# Altium schematic sheet Sheet3.SchDoc
size A3
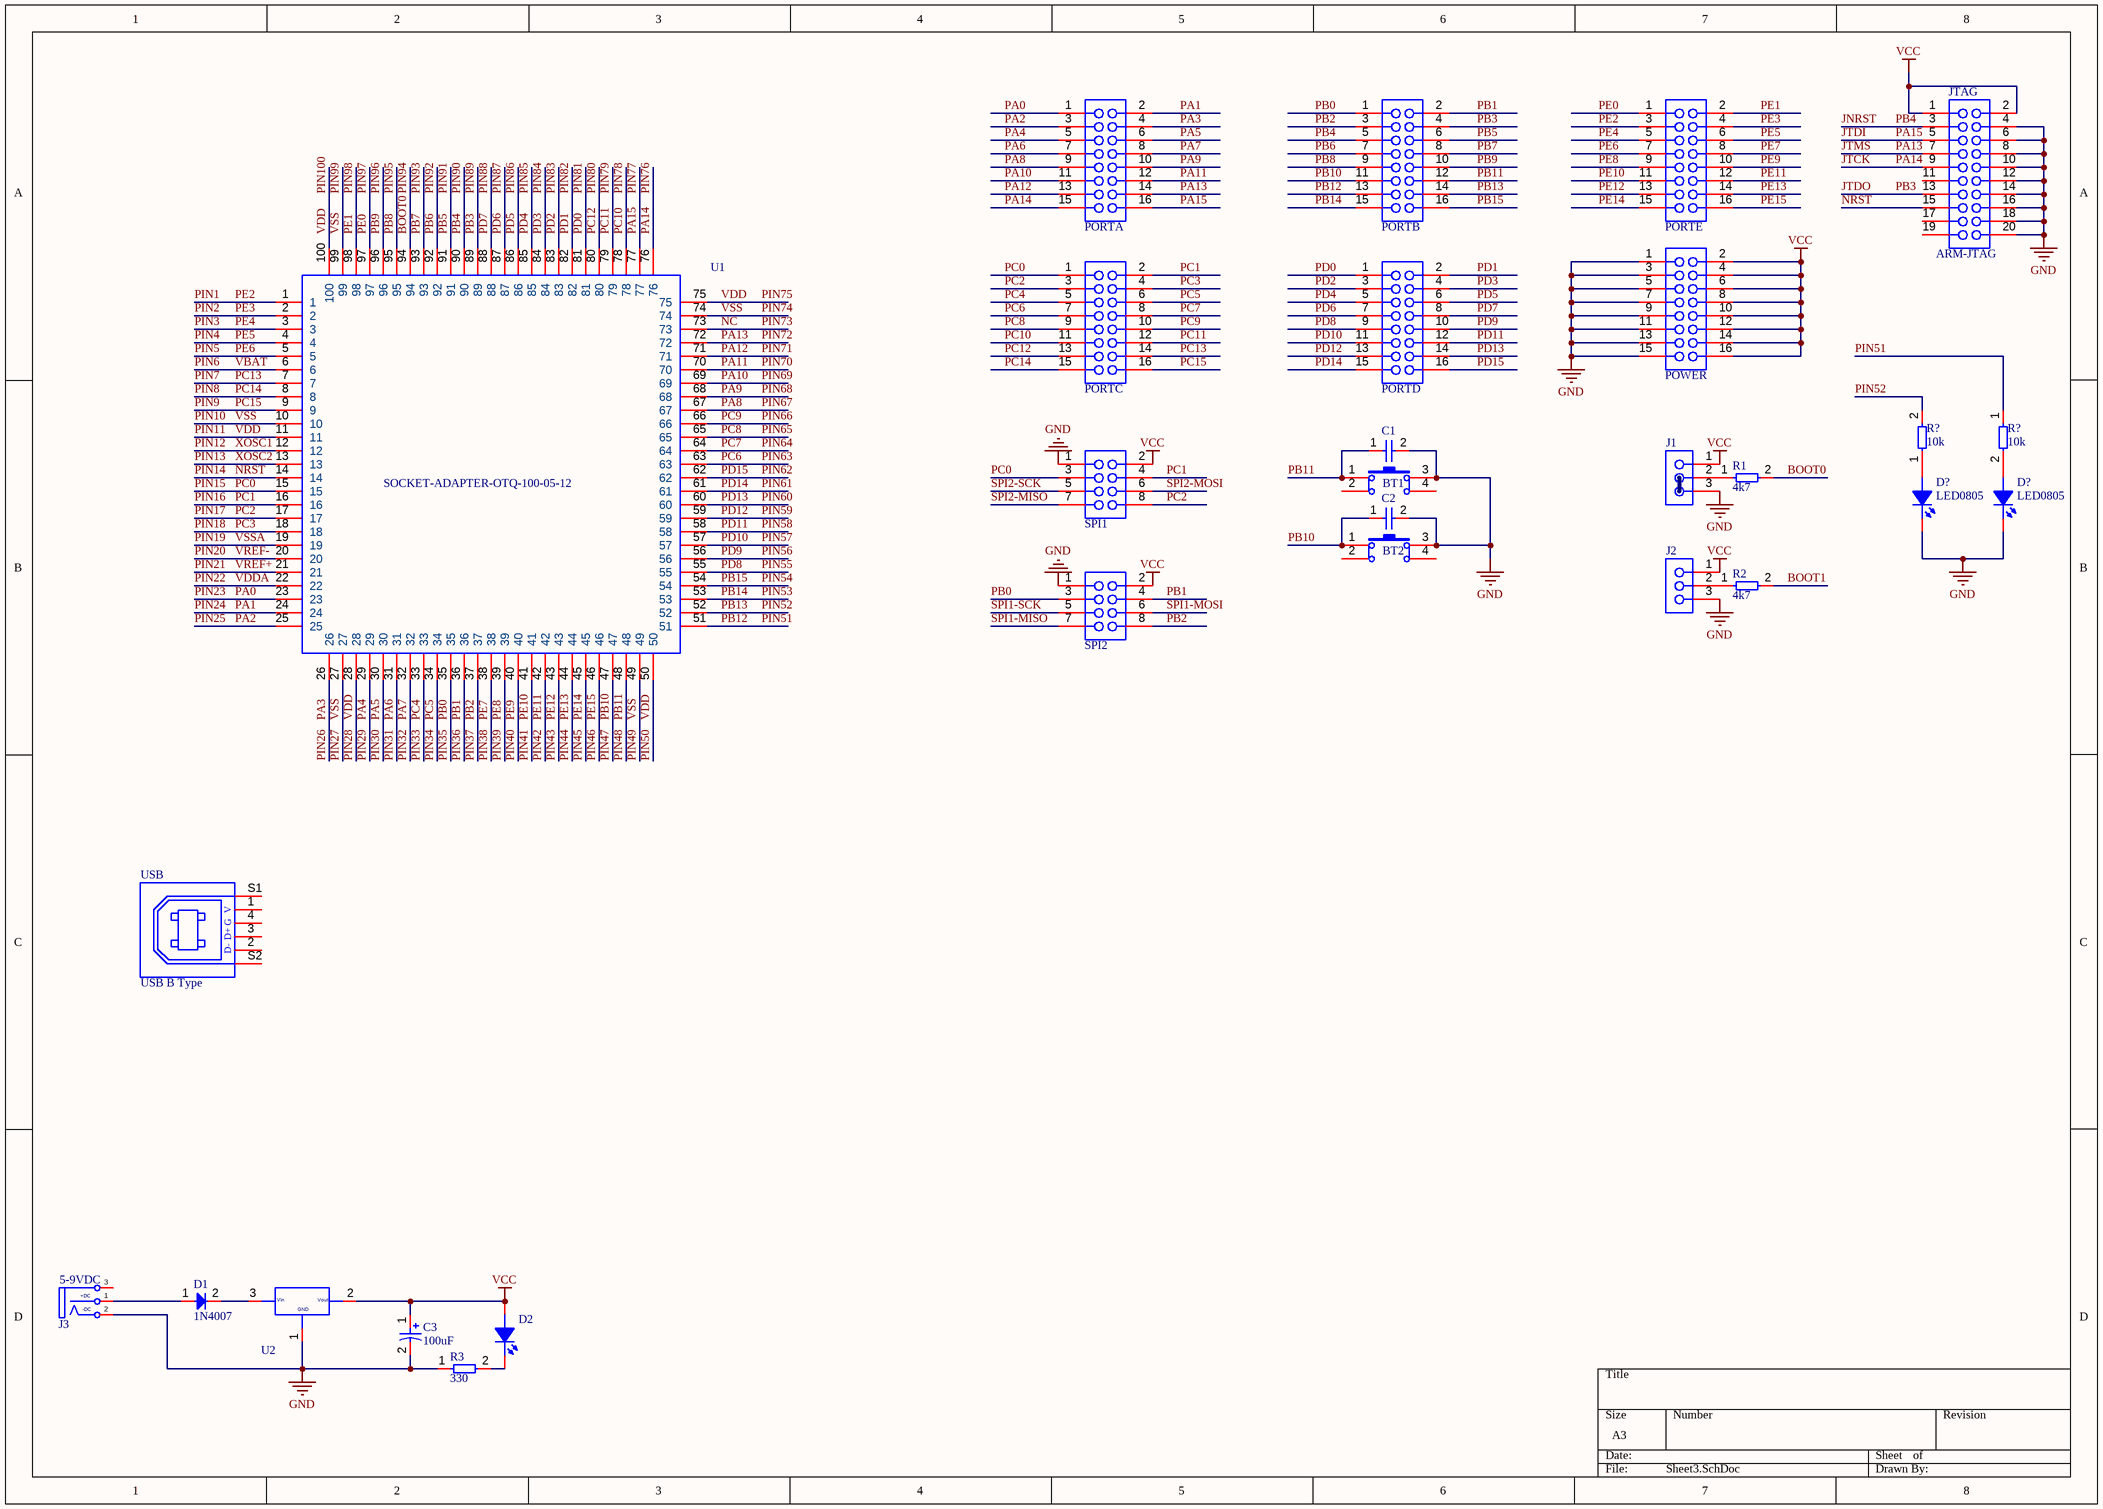
[diagram p0: Sheet3.SchDoc]

## Parts
(Parts that share a designator on the sheet are numbered #1, #2 ... from top to bottom, then left to right.)
BT1  Button Hole  [BUTTON_HOLE_5.0mm]  (value not drawn)
BT2  Button Hole  [BUTTON_HOLE_5.0mm]  (value not drawn)
C1  103  [C0805]  (value not drawn)
C2  103  [C0805]  (value not drawn)
C3  100uF  [CAP_RAD_7mm]
D1  1N4007  [DO-214AC(SMA)]
D2  LED0805  [L0805RED]  (value not drawn)
D?#1  LED0805  [L0805RED]
D?#2  LED0805  [L0805RED]
J1  BOOT0  [Header 3x1 TH Pitch 2.54mm]  (value not drawn)
J2  BOOT1  [Header 3x1 TH Pitch 2.54mm]  (value not drawn)
J3  5-9VDC  [DC_K375A_Power]
JTAG  ARM-JTAG  [IDC_CONNECTOR_20_2.54]
PORTA  Header 8x2 TH Pitch 2.54mm  [Header 8x2 TH Pitch 2.54mm]  (value not drawn)
PORTB  Header 8x2 TH Pitch 2.54mm  [Header 8x2 TH Pitch 2.54mm]  (value not drawn)
PORTC  Header 8x2 TH Pitch 2.54mm  [Header 8x2 TH Pitch 2.54mm]  (value not drawn)
PORTD  Header 8x2 TH Pitch 2.54mm  [Header 8x2 TH Pitch 2.54mm]  (value not drawn)
PORTE  Header 8x2 TH Pitch 2.54mm  [Header 8x2 TH Pitch 2.54mm]  (value not drawn)
POWER  Header 8x2 TH Pitch 2.54mm  [Header 8x2 TH Pitch 2.54mm]  (value not drawn)
R1  4k7  [R0805]
R2  4k7  [R0805]
R3  330  [R0805]
R?#1  10k  [R0805]
R?#2  10k  [R0805]
SPI1  Header 4x2 TH Pitch 2.54mm  [Header 4x2 TH Pitch 2.54mm]  (value not drawn)
SPI2  Header 4x2 TH Pitch 2.54mm  [Header 4x2 TH Pitch 2.54mm]  (value not drawn)
U1  SOCKET-ADAPTER-OTQ-100-05-12  [SOCKET-ADAPTER-OTQ-100-05-12]
U2  AMS1117  [SOT223-3]  (value not drawn)
USB  USB B Type  [USB-B-TYPE]

## Nets
GND: BT1.3 BT2.3 C1.2 C2.2 C3.2 D?#1.2(K) D?#2.2(K) J1.3 J2.3 J3.2(DC-) JTAG.4 JTAG.6 JTAG.8 JTAG.10 JTAG.12 JTAG.14 JTAG.16 JTAG.18 JTAG.20 POWER.1 POWER.3 POWER.5 POWER.7 POWER.9 POWER.11 POWER.13 POWER.15 R3.1 SPI1.1 SPI2.1 U2.1
VCC: C3.1 D2.1(A) J1.1 J2.1 JTAG.1 JTAG.2 POWER.2 POWER.4 POWER.6 POWER.8 POWER.10 POWER.12 POWER.14 POWER.16 SPI1.2 SPI2.2 U2.2
BOOT0: R1.2 U1.94  [also labelled PIN94]
BOOT1: R2.2
JNRST: JTAG.3 PORTB.5 U1.90  [also labelled PB4, PIN90]
JTCK: JTAG.9 PORTA.15 U1.76  [also labelled PA14, PIN76]
JTDI: JTAG.5 PORTA.16 U1.77  [also labelled PA15, PIN77]
JTDO: JTAG.13 PORTB.4 U1.89  [also labelled PB3, PIN89]
JTMS: JTAG.7 PORTA.14 U1.72  [also labelled PA13, PIN72]
NC: U1.73  [also labelled PIN73]
NRST: JTAG.15 U1.14  [also labelled PIN14]
PA0: PORTA.1 U1.23  [also labelled PIN23]
PA1: PORTA.2 U1.24  [also labelled PIN24]
PA2: PORTA.3 U1.25  [also labelled PIN25]
PA3: PORTA.4 U1.26  [also labelled PIN26]
PA4: PORTA.5 U1.29  [also labelled PIN29]
PA5: PORTA.6 U1.30  [also labelled PIN30]
PA6: PORTA.7 U1.31  [also labelled PIN31]
PA7: PORTA.8 U1.32  [also labelled PIN32]
PA8: PORTA.9 U1.67  [also labelled PIN67]
PA9: PORTA.10 U1.68  [also labelled PIN68]
PA10: PORTA.11 U1.69  [also labelled PIN69]
PA11: PORTA.12 U1.70  [also labelled PIN70]
PA12: PORTA.13 U1.71  [also labelled PIN71]
PB0: PORTB.1 SPI2.3 U1.35  [also labelled PIN35]
PB1: PORTB.2 SPI2.4 U1.36  [also labelled PIN36]
PB2: PORTB.3 SPI2.8 U1.37  [also labelled PIN37]
PB5: PORTB.6 U1.91  [also labelled PIN91]
PB6: PORTB.7 U1.92  [also labelled PIN92]
PB7: PORTB.8 U1.93  [also labelled PIN93]
PB8: PORTB.9 U1.95  [also labelled PIN95]
PB9: PORTB.10 U1.96  [also labelled PIN96]
PB10: BT2.1 C2.1 PORTB.11 U1.47  [also labelled PIN47]
PB11: BT1.1 C1.1 PORTB.12 U1.48  [also labelled PIN48]
PB12: PORTB.13 R?#2.1 U1.51  [also labelled PIN51]
PB13: PORTB.14 R?#1.2 U1.52  [also labelled PIN52]
PB14: PORTB.15 U1.53  [also labelled PIN53]
PB15: PORTB.16 U1.54  [also labelled PIN54]
PC0: PORTC.1 SPI1.3 U1.15  [also labelled PIN15]
PC1: PORTC.2 SPI1.4 U1.16  [also labelled PIN16]
PC2: PORTC.3 SPI1.8 U1.17  [also labelled PIN17]
PC3: PORTC.4 U1.18  [also labelled PIN18]
PC4: PORTC.5 U1.33  [also labelled PIN33]
PC5: PORTC.6 U1.34  [also labelled PIN34]
PC6: PORTC.7 U1.63  [also labelled PIN63]
PC7: PORTC.8 U1.64  [also labelled PIN64]
PC8: PORTC.9 U1.65  [also labelled PIN65]
PC9: PORTC.10 U1.66  [also labelled PIN66]
PC10: PORTC.11 U1.78  [also labelled PIN78]
PC11: PORTC.12 U1.79  [also labelled PIN79]
PC12: PORTC.13 U1.80  [also labelled PIN80]
PC13: PORTC.14 U1.7  [also labelled PIN7]
PC14: PORTC.15 U1.8  [also labelled PIN8]
PC15: PORTC.16 U1.9  [also labelled PIN9]
PD0: PORTD.1 U1.81  [also labelled PIN81]
PD1: PORTD.2 U1.82  [also labelled PIN82]
PD2: PORTD.3 U1.83  [also labelled PIN83]
PD3: PORTD.4 U1.84  [also labelled PIN84]
PD4: PORTD.5 U1.85  [also labelled PIN85]
PD5: PORTD.6 U1.86  [also labelled PIN86]
PD6: PORTD.7 U1.87  [also labelled PIN87]
PD7: PORTD.8 U1.88  [also labelled PIN88]
PD8: PORTD.9 U1.55  [also labelled PIN55]
PD9: PORTD.10 U1.56  [also labelled PIN56]
PD10: PORTD.11 U1.57  [also labelled PIN57]
PD11: PORTD.12 U1.58  [also labelled PIN58]
PD12: PORTD.13 U1.59  [also labelled PIN59]
PD13: PORTD.14 U1.60  [also labelled PIN60]
PD14: PORTD.15 U1.61  [also labelled PIN61]
PD15: PORTD.16 U1.62  [also labelled PIN62]
PE0: PORTE.1 U1.97  [also labelled PIN97]
PE1: PORTE.2 U1.98  [also labelled PIN98]
PE2: PORTE.3 U1.1  [also labelled PIN1]
PE3: PORTE.4 U1.2  [also labelled PIN2]
PE4: PORTE.5 U1.3  [also labelled PIN3]
PE5: PORTE.6 U1.4  [also labelled PIN4]
PE6: PORTE.7 U1.5  [also labelled PIN5]
PE7: PORTE.8 U1.38  [also labelled PIN38]
PE8: PORTE.9 U1.39  [also labelled PIN39]
PE9: PORTE.10 U1.40  [also labelled PIN40]
PE10: PORTE.11 U1.41  [also labelled PIN41]
PE11: PORTE.12 U1.42  [also labelled PIN42]
PE12: PORTE.13 U1.43  [also labelled PIN43]
PE13: PORTE.14 U1.44  [also labelled PIN44]
PE14: PORTE.15 U1.45  [also labelled PIN45]
PE15: PORTE.16 U1.46  [also labelled PIN46]
PIN6: U1.6  [also labelled VBAT]
PIN10: U1.10 U1.27 U1.49 U1.74 U1.99  [also labelled PIN27, PIN49, PIN74, PIN99, VSS]
PIN12: U1.12  [also labelled XOSC1]
PIN13: U1.13  [also labelled XOSC2]
PIN19: U1.19  [also labelled VSSA]
PIN20: U1.20  [also labelled VREF-]
PIN21: U1.21  [also labelled VREF+]
PIN22: U1.22  [also labelled VDDA]
PIN100: U1.11 U1.28 U1.50 U1.75 U1.100  [also labelled PIN11, PIN28, PIN50, PIN75, VDD]
SPI1-MISO: SPI2.7
SPI1-MOSI: SPI2.6
SPI1-SCK: SPI2.5
SPI2-MISO: SPI1.7
SPI2-MOSI: SPI1.6
SPI2-SCK: SPI1.5
NetD1_1: D1.1 J3.1(DS+)
NetD1_2: D1.2 U2.3
NetD2_2: D2.2(K) R3.2
NetD?#1_1: D?#1.1(A) R?#1.1
NetD?#2_1: D?#2.1(A) R?#2.2
NetJ1_2: J1.2 R1.1
NetJ2_2: J2.2 R2.1

Not connected (* = marked no-connect by the designer): BT1 2 4; BT2 2 4; J3 3(T); JTAG 11 17 19; USB 1 2 3 4 S1 S2

## Notes on the sheet
- (in symbol AMS1117(SOT-223)) Vin; Vout; GND
- (in symbol JackDC) +DC; -DC
- (in symbol USB B Type) V; G; D+; D-

## Library data of the parts
C1 C2 = C0805
C3 = Capacitor(Radian)
D1 = Diode 1N4007-DO214AC(SMA)
J1 J2 = Header 3x1 TH Pitch 2.54mm
J3 = JackDC
JTAG = IDC_2.54_10x2
R1-R3 R?#1 R?#2 = Resistor SMD
U2 = AMS1117(SOT-223)